# EAGLE design board (1) (EAGLE 9.6.2)
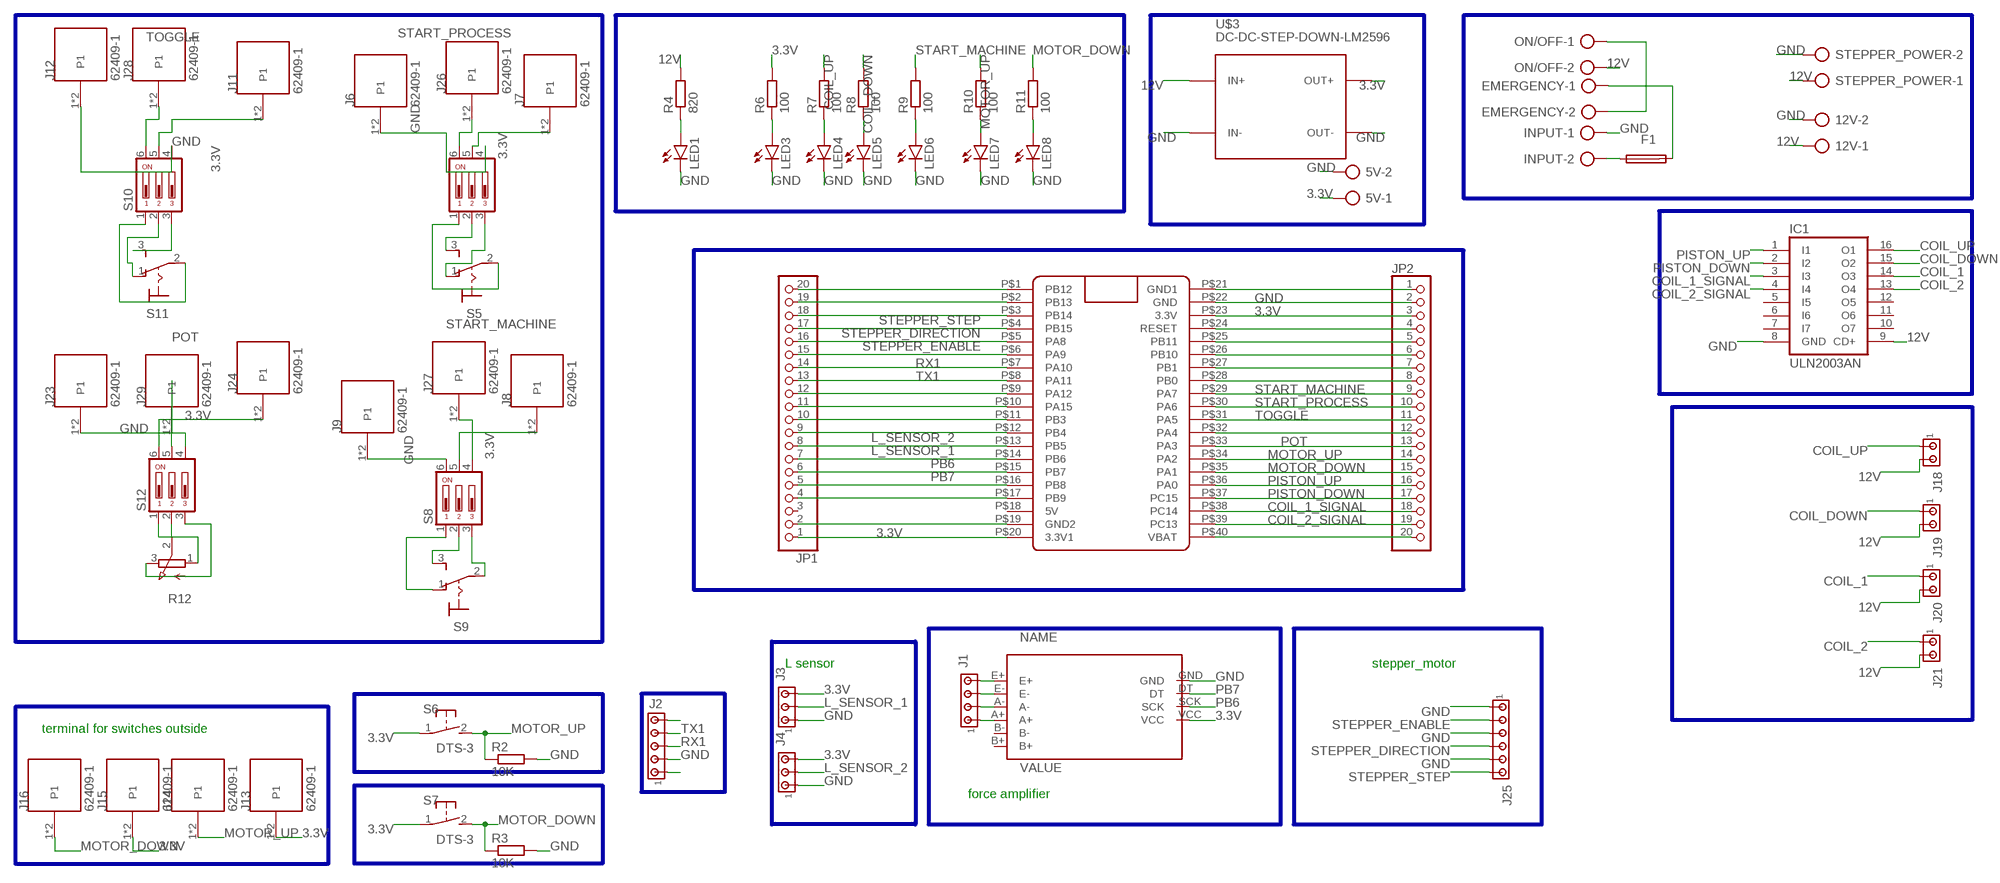
[diagram p0: schematic, sheet 1]

## Parts
5V  AK300/2  [AK300/2]
12V  AK300/2  [AK300/2]
EMERGENCY  AK300/2  [AK300/2]
F1  SH22  [SH22]
IC1  ULN2003AN  [DIL16]
INPUT  AK300/2  [AK300/2]
J1  MTA04-100  [10X04MTA]
J2  MTA05-100  [10X05MTA]
J3  MTA03-100  [10X03MTA]
J4  MTA03-100  [10X03MTA]
J6  62409-1  [TE_62409-1]
J7  62409-1  [TE_62409-1]
J8  62409-1  [TE_62409-1]
J9  62409-1  [TE_62409-1]
J11  62409-1  [TE_62409-1]
J12  62409-1  [TE_62409-1]
J13  62409-1  [TE_62409-1]
J14  62409-1  [TE_62409-1]
J15  62409-1  [TE_62409-1]
J16  62409-1  [TE_62409-1]
J18  MTA02-100  [10X02MTA]
J19  MTA02-100  [10X02MTA]
J20  MTA02-100  [10X02MTA]
J21  MTA02-100  [10X02MTA]
J23  62409-1  [TE_62409-1]
J24  62409-1  [TE_62409-1]
J25  MTA06-100  [10X06MTA]
J26  62409-1  [TE_62409-1]
J27  62409-1  [TE_62409-1]
J28  62409-1  [TE_62409-1]
J29  62409-1  [TE_62409-1]
JP1  PINHD-1X20  [1X20]
JP2  PINHD-1X20  [1X20]
LED1  LED3MM  [LED3MM]
LED3  LED3MM  [LED3MM]
LED4  LED3MM  [LED3MM]
LED5  LED3MM  [LED3MM]
LED6  LED3MM  [LED3MM]
LED7  LED3MM  [LED3MM]
LED8  LED3MM  [LED3MM]
ON/OFF  AK300/2  [AK300/2]
R2  10K  R-EU_0204/7  [0204/7]
R3  10K  R-EU_0204/7  [0204/7]
R4  820  R-EU_0204/7  [0204/7]
R6  100  R-EU_0204/7  [0204/7]
R7  100  R-EU_0204/7  [0204/7]
R8  100  R-EU_0204/7  [0204/7]
R9  100  R-EU_0204/7  [0204/7]
R10  100  R-EU_0204/7  [0204/7]
R11  100  R-EU_0204/7  [0204/7]
R12  3RP/1610N  [3RP/1610N]
S4  DP03  [DP-03]
S5  320-916  [320-916]
S6  DTS-3  [DTS-3]
S7  DTS-3  [DTS-3]
S8  DP03  [DP-03]
S9  320-916  [320-916]
S10  DP03  [DP-03]
S11  320-916  [320-916]
S12  DP03  [DP-03]
STEPPER_POWER  AK300/2  [AK300/2]
U$1  BLUE_PILL  [BLUE_PILL]
U$2  HX711A  [HX711]
U$3  DC-DC-STEP-DOWN-LM2596  [DC-DC-STEP-DOWN-LM2596]

## Nets
3.3V: 5V.1 J3.3 J4.3 J7.1 J7.2(P1) J8.1 J8.2(P1) J11.1 J11.2(P1) J13.1 J13.2(P1) J15.1 J15.2(P1) J24.1 J24.2(P1) JP1.1 JP2.3 R6.2 S4.5 S6.1 S7.1 S8.5 S10.5 S12.6 U$1.P$20(3.3V1) U$1.P$23(3.3V) U$2.VCC U$3.OUT+
12V: 12V.1 IC1.9(CD+) J18.2 J19.2 J20.2 J21.2 ON/OFF.2 R4.2 STEPPER_POWER.1 U$3.IN+
COIL_1: IC1.14(O3) J20.1
COIL_1_SIGNAL: IC1.3(I3) JP2.18 U$1.P$38(PC14)
COIL_2: IC1.13(O4) J21.1
COIL_2_SIGNAL: IC1.4(I4) JP2.19 U$1.P$39(PC13)
COIL_DOWN: IC1.15(O2) J19.1 R8.2
COIL_UP: IC1.16(O1) J18.1 R7.2
GND: 5V.2 12V.2 IC1.8(GND) INPUT.1 J2.2 J3.1 J4.1 J6.1 J6.2(P1) J9.1 J9.2(P1) J12.1 J12.2(P1) J23.1 J23.2(P1) J25.1 J25.3 J25.5 JP1.2 JP2.2 LED1.K(C) LED3.K(C) LED4.K(C) LED5.K(C) LED6.K(C) LED7.K(C) LED8.K(C) R2.2 R3.2 S4.4 S8.6 S10.4 S12.4 STEPPER_POWER.2 U$1.P$19(GND2) U$1.P$22(GND) U$2.GND U$3.IN- U$3.OUT-
L_SENSOR_1: J3.2 JP1.8 U$1.P$13(PB5)
L_SENSOR_2: J4.2 JP1.9 U$1.P$12(PB4)
MOTOR_DOWN: J16.1 J16.2(P1) JP2.15 R3.1 R11.2 S7.2 U$1.P$35(PA1)
MOTOR_UP: J14.1 J14.2(P1) JP2.14 R2.1 R10.2 S6.2 U$1.P$34(PA2)
N$1: J1.4 U$2.E+
N$2: J1.3 U$2.E-
N$3: J1.2 U$2.A-
N$4: J1.1 U$2.A+
N$5: LED1.A R4.1
N$7: LED3.A R6.1
N$8: LED4.A R7.1
N$9: LED5.A R8.1
N$10: LED6.A R9.1
N$11: LED7.A R10.1
N$12: LED8.A R11.1
N$13: F1.1 INPUT.2
N$14: S4.1 S5.2(P)
N$15: S4.2 S5.3(S)
N$16: JP1.4 U$1.P$17(PB9)
N$17: JP1.5 U$1.P$16(PB8)
N$18: JP1.10 U$1.P$11(PB3)
N$19: JP1.11 U$1.P$10(PA15)
N$20: JP1.12 U$1.P$9(PA12)
N$21: JP1.13 U$1.P$8(PA11)
N$22: EMERGENCY.1 F1.2
N$23: EMERGENCY.2 ON/OFF.1
N$24: J2.1
N$25: JP2.20 U$1.P$40(VBAT)
N$26: JP2.7 U$1.P$27(PB1)
N$27: JP2.8 U$1.P$28(PB0)
N$28: JP1.20 U$1.P$1(PB12)
N$29: JP1.19 U$1.P$2(PB13)
N$30: S4.3 S5.1(O)
N$31: S10.1 S11.2(P)
N$32: S8.3 S9.2(P)
N$33: S8.1 S9.1(O)
N$34: JP2.1 U$1.P$21(GND1)
N$35: JP2.4 U$1.P$24(RESET)
N$36: S8.2 S9.3(S)
N$37: S10.3 S11.3(S)
N$38: S10.2 S11.1(O)
N$39: J2.5
N$40: JP2.6 U$1.P$26(PB10)
N$41: R12.3(E) S12.3
N$42: R12.1(A) S12.1
N$43: R12.2(S) S12.2
N$44: JP2.12 U$1.P$32(PA4)
N$45: JP2.5 U$1.P$25(PB11)
PB6: JP1.7 U$1.P$14(PB6) U$2.SCK
PB7: JP1.6 U$1.P$15(PB7) U$2.DT
PISTON_DOWN: IC1.2(I2) JP2.17 U$1.P$37(PC15)
PISTON_UP: IC1.1(I1) JP2.16 U$1.P$36(PA0)
POT: J29.1 J29.2(P1) JP2.13 S12.5 U$1.P$33(PA3)
RX1: J2.3 JP1.15 U$1.P$6(PA9)
START_MACHINE: J27.1 J27.2(P1) JP2.9 R9.2 S8.4 U$1.P$29(PA7)
START_PROCESS: J26.1 J26.2(P1) JP2.10 S4.6 U$1.P$30(PA6)
STEPPER_DIRECTION: J25.4 JP1.17 U$1.P$4(PB15)
STEPPER_ENABLE: J25.2 JP1.16 U$1.P$5(PA8)
STEPPER_STEP: J25.6 JP1.18 U$1.P$3(PB14)
TOGGLE: J28.1 J28.2(P1) JP2.11 S10.6 U$1.P$31(PA5)
TX1: J2.4 JP1.14 U$1.P$7(PA10)
Unconnected: IC1.5(I5) IC1.6(I6) IC1.7(I7) IC1.10(O7) IC1.11(O6) IC1.12(O5) JP1.3 U$1.P$18(5V) U$2.B+ U$2.B-

## Buses
B$4
B$5
B$6
B$7
B$8
B$9
B$10
B$12
B$13
B$15
B$16
B$14
B$17
B$1

## Notes on the sheet
- L sensor | stepper_motor
- terminal for switches outside
- force amplifier

## Library data of the parts
5V 12V EMERGENCY INPUT ON/OFF STEPPER_POWER = con-ptr500:AK300/2: CONNECTOR; OC_FARNELL: unknown; OC_NEWARK: unknown
F1 = fuse:SH22: FUSE HOLDER CS PFP30, Schukat; OC_FARNELL: unknown; OC_NEWARK: unknown
IC1 = uln-udn:ULN2003A: DRIVER ARRAY
J1 = con-amp:MTA04-100: AMP connector
J2 = con-amp:MTA05-100: AMP connector
J3 J4 = con-amp:MTA03-100: AMP connector
J6-J9 J11-J16 J23 J24 J26-J29 = 62409-1:62409-1: CONN QC TAB 0.250 SOLDER Check availability <https://pricing.snapeda.com/parts/62409-1/TE%20Connectivity/view-part?ref=eda>; AVAILABILITY: In Stock; COMMENT: 62409-1; DESCRIPTION: Faston 20-16 AWG Straight Non-Insulated Printed Circuit Board Tab Terminal; MF: TE Connectivity; MP: 62409-1; PACKAGE: None; PRICE: None; PURCHASE-URL: https://pricing.snapeda.com/search/part/62409-1/?ref=eda
J18-J21 = con-amp:MTA02-100: AMP connector
J25 = con-amp:MTA06-100: AMP connector Connection corrected 2014-09-19
JP1 JP2 = pinhead:PINHD-1X20: PIN HEADER
LED1 LED3-LED8 = led:LED: LED OSRAM: - CHIPLED LG R971, LG N971, LY N971, LG Q971, LY Q971, LO R971, LY R971 LH N974, LH R974 LS Q976, LO Q976, LY Q976 LO Q996 - Hyper CHIPLED LW Q18S LB Q993, LB Q99A, LB R99A - SideLED LS A670, LO A670, LY A670, LG A670, LP A670 LB A673, LV A673, LT A673, LW A673 LH A674 LY A675 LS A676, LA A676, LO A676, LY A676, LW A676 LS A679, LY A679, LG A679 - Hyper Micro SIDELED® LS Y876, LA Y876, LO Y876, LY Y876 LT Y87S - SmartLED LW L88C, LW L88S LB L89C, LB L89S, LG L890 LS L89K, LO L89K, LY L89K LS L896, LA L896, LO L896, LY L896 - TOPLED LS T670, LO T670, LY T670, LG T670, LP T670 LSG T670, LSP T670, LSY T670, LOP T670, LYG T670 LG T671, LOG T671, LSG T671 LB T673, LV T673, LT T673, LW T673 LH T674 LS T676, LA T676, LO T676, LY T676, LB T676, LH T676, LSB T676, LW T676 LB T67C, LV T67C, LT T67C, LS T67K, LO T67K, LY T67K, LW E67C LS E67B, LA E67B, LO E67B, LY E67B, LB E67C, LV E67C, LT E67C LW T67C LS T679, LY T679, LG T679 LS T770, LO T770, LY T770, LG T770, LP T770 LB T773, LV T773, LT T773, LW T773 LH T774 LS E675, LA E675, LY E675, LS T675 LS T776, LA T776, LO T776, LY T776, LB T776 LHGB T686 LT T68C, LB T68C - Hyper Mini TOPLED® LB M676 - Mini TOPLED Santana® LG M470 LS M47K, LO M47K, LY M47K Source: http://www.osram.convergy.de LUXEON: - LUMILED® LXK2-PW12-R00, LXK2-PW12-S00, LXK2-PW14-U00, LXK2-PW14-V00 LXK2-PM12-R00, LXK2-PM12-S00, LXK2-PM14-U00 LXK2-PE12-Q00, LXK2-PE12-R00, LXK2-PE12-S00, LXK2-PE14-T00, LXK2-PE14-U00 LXK2-PB12-K00, LXK2-PB12-L00, LXK2-PB12-M00, LXK2-PB14-N00, LXK2-PB14-P00, LXK2-PB14-Q00 LXK2-PR12-L00, LXK2-PR12-M00, LXK2-PR14-Q00, LXK2-PR14-R00 LXK2-PD12-Q00, LXK2-PD12-R00, LXK2-PD12-S00 LXK2-PH12-R00, LXK2-PH12-S00 LXK2-PL12-P00, LXK2-PL12-Q00, LXK2-PL12-R00 Source: www.luxeon.com KINGBRIGHT: KA-3528ASYC Source: www.kingbright.com
R2-R4 R6-R11 = resistor:R-EU_: RESISTOR, European symbol
R12 = pot:3RP/1610N: 16mm Potentiometer one level Source: http://www.alphapotentiometers.net/html/16mm_pot_2.html
S4 S8 S10 S12 = switch-dil:DP03: DIL/CODE SWITCH; MPN: MCDP03; OC_FARNELL: 1522004; OC_NEWARK: 74M2976
S5 S9 S11 = switch:320-916: TOGGLE SWITCH distributor RS Components
S6 S7 = switch-tact:DTS-3
U$1 = BluePill:BLUE_PILL
U$2 = HX711:HX711
U$3 = buck 3A:DC-DC-STEP-DOWN-LM2596: DC/DC Step-Down Regulator based on LM2596-ADJ chip LM2596 datasheet available here: http://www.ti.com/lit/ds/symlink/lm2596.pdf Click here to find device on ebay.com <http://www.ebay.com/sch/lm2596+power+regulator>

## Board
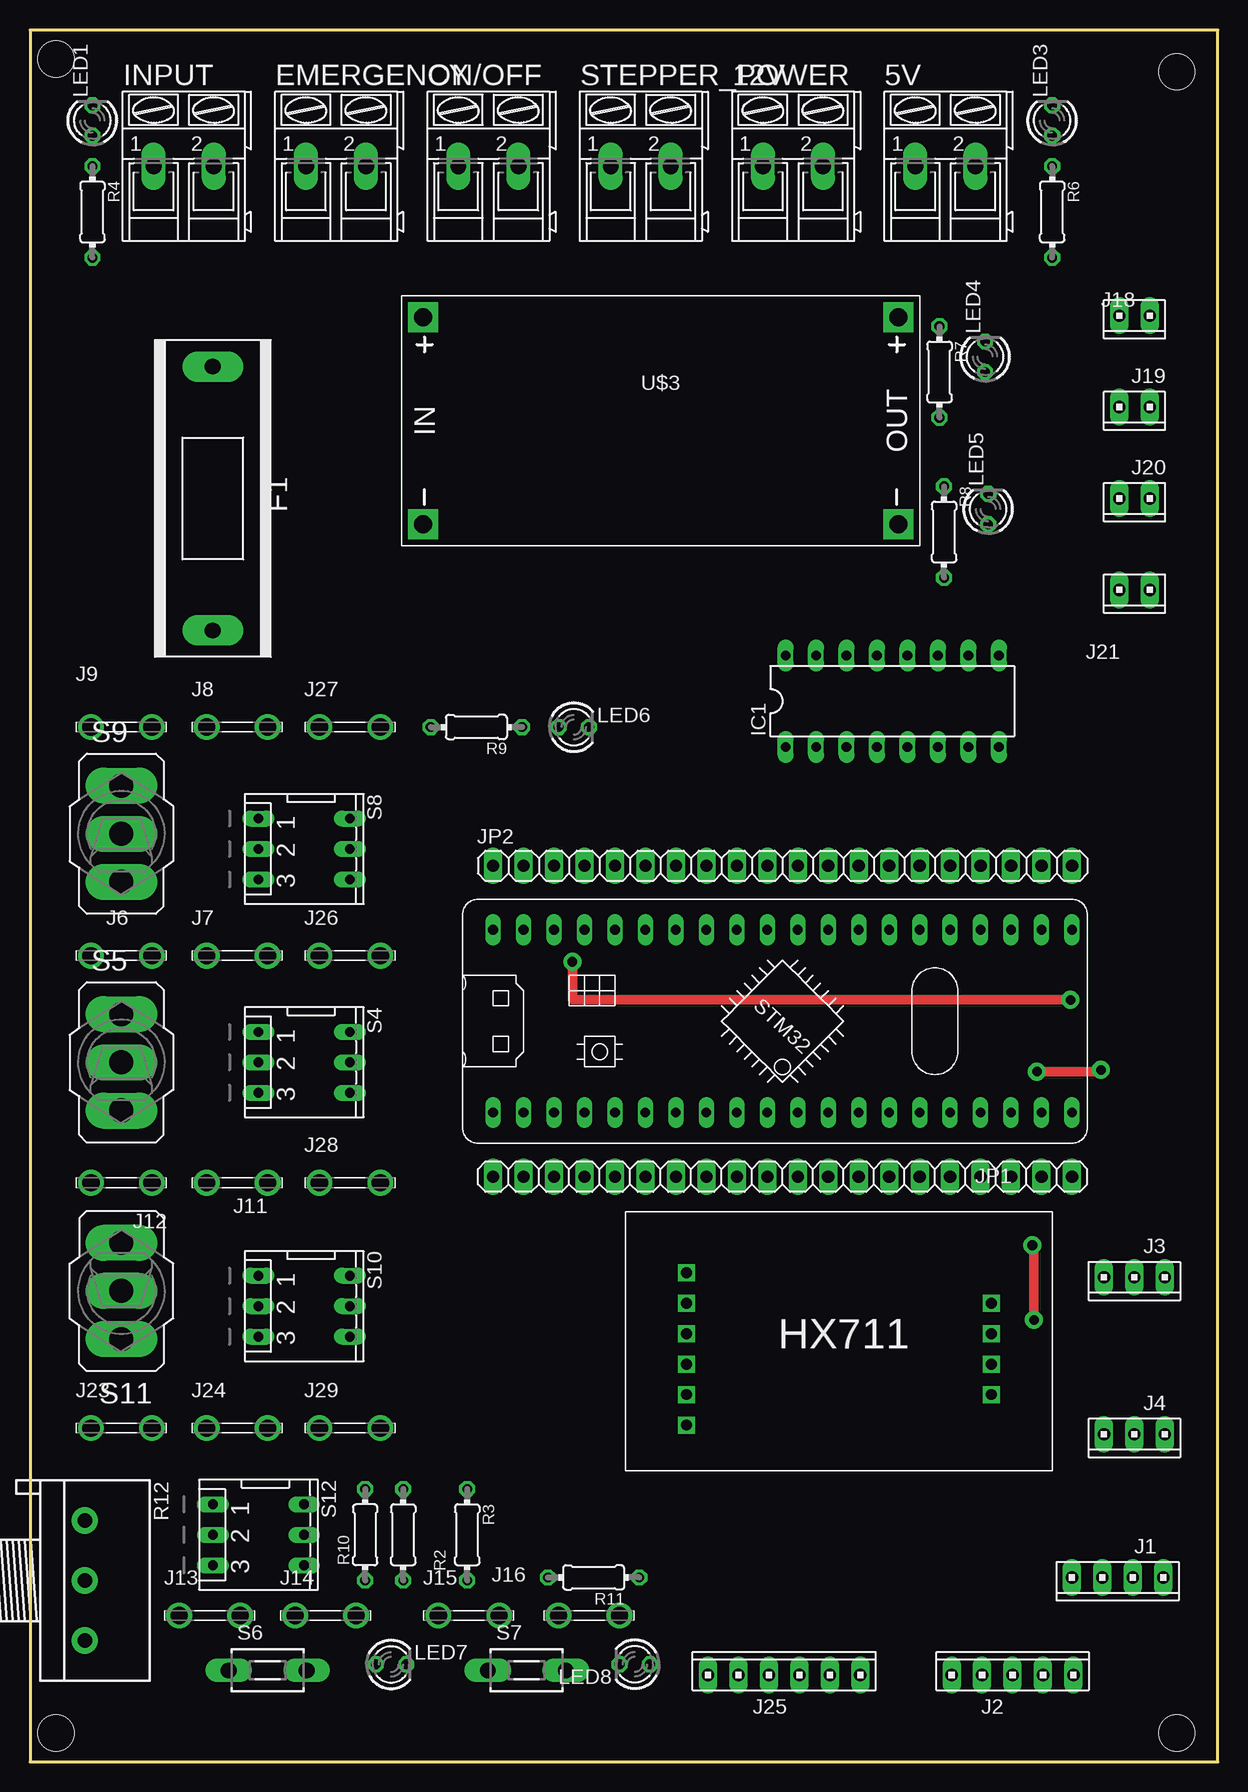
[diagram p1: board, top side]
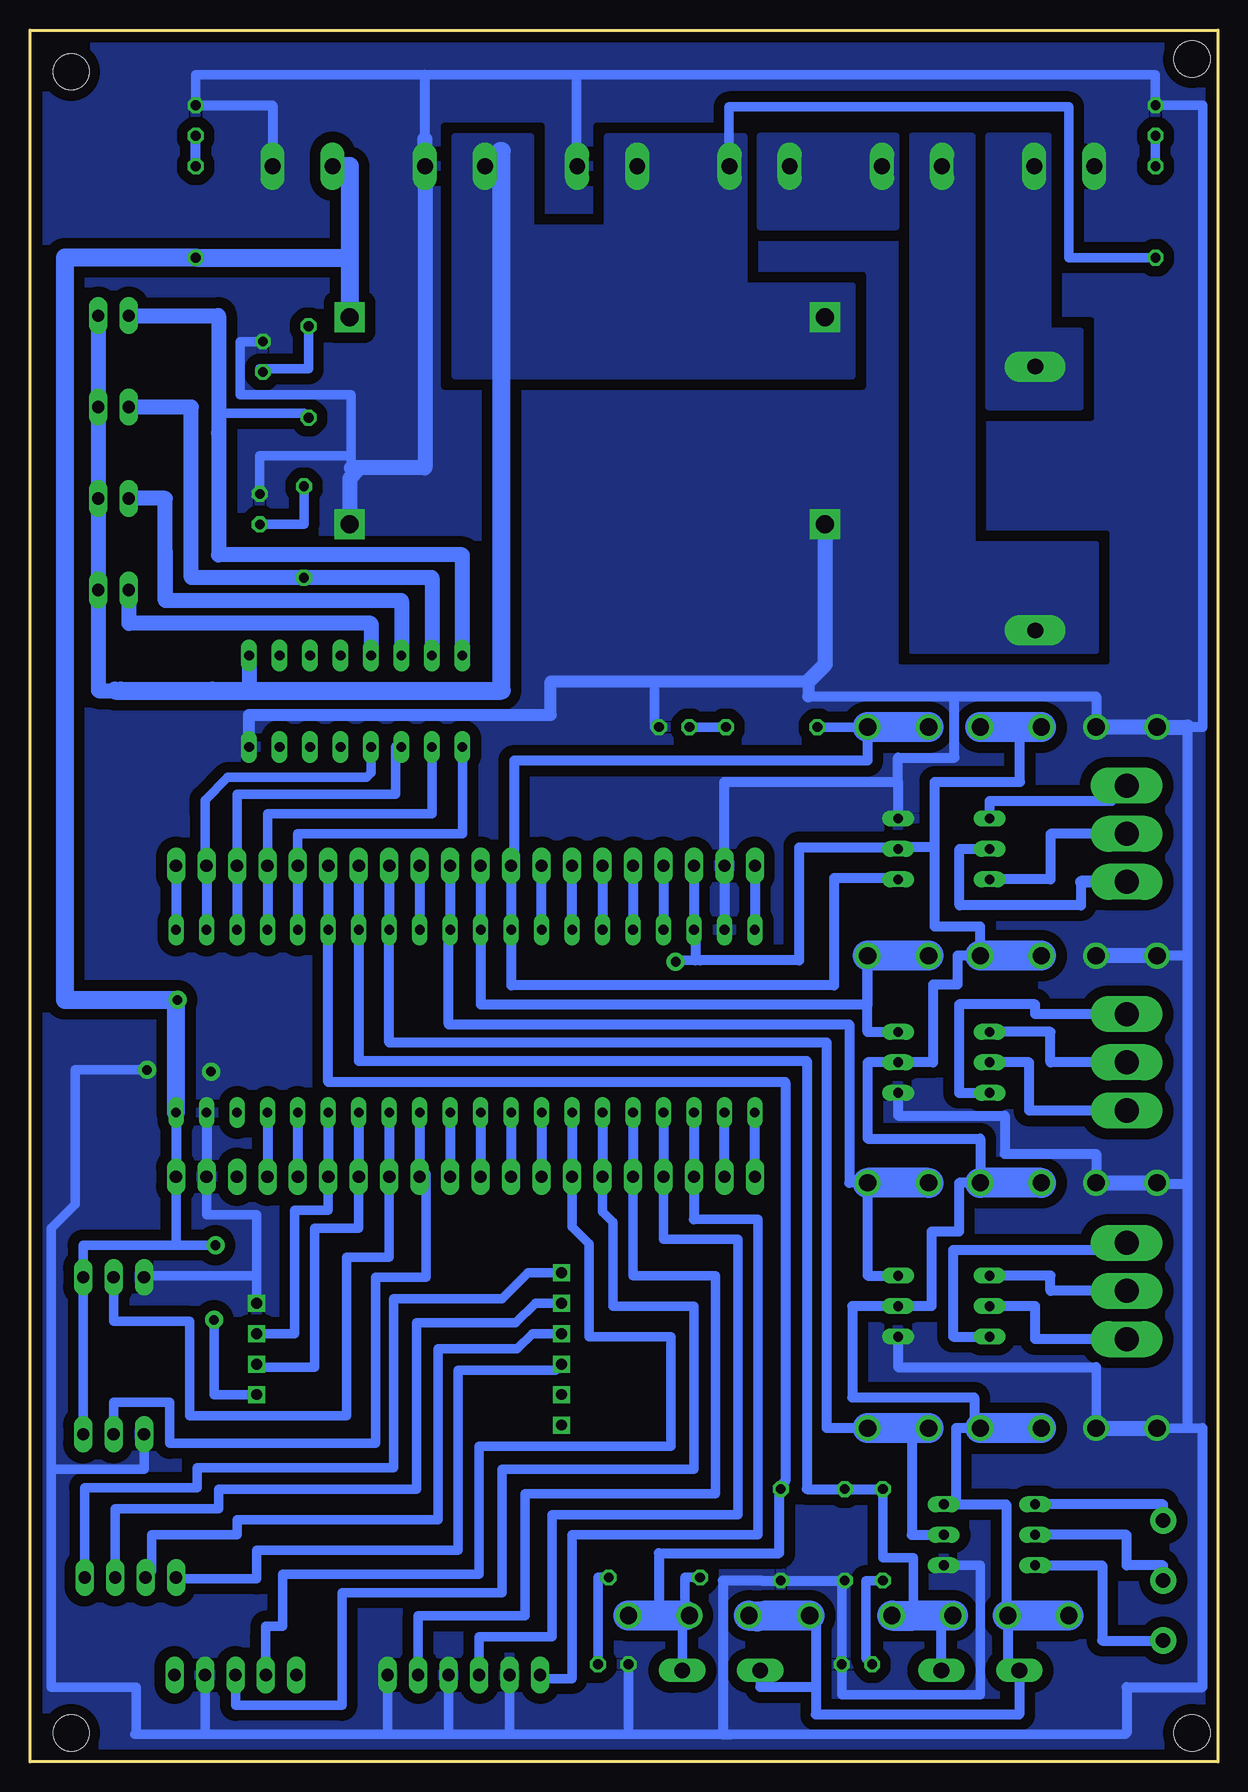
[diagram p2: board, bottom side, seen from below]

Size 99.04 x 144.32 mm. Coordinates in mm from the lower left corner, seen from the top.
Outline: 0,0 99.04,0 99.04,144.32 0,144.32 0,0
Copper layers (1*16): Top 0.035mm / dielectric 1.5mm / Bottom 0.035mm
Design rules "default *": minimum track width 0.6mm, minimum drill 0.35mm, track to track 0.6mm, track to pad 0.6mm, pad to pad 0.6mm, via to via 0.6mm, smd to smd 6mil, copper to edge 0.6mm, drill to drill 6mil, minimum pad ring 10mil, minimum via ring 8mil, stop-mask expansion 4mil, vias tented up to drill 0mil, thermal gap 0mil
Holes 3 mm at 2.16,141.91 2.16,2.41 95.61,2.41 95.61,140.84

### Footprints (pad centres in the part's own frame; a part is rotated, then mirrored left to right if it is on the bottom)
AK300/2 = drill 1.321 long: 1 -2.515,0; 2 2.489,0
SH22 = drill 1.321 pad 2.54 long: 1 -10.998,0; 2 10.998,0
DIL16 = drill 0.813 long: 1 -8.89,-3.81; 2 -6.35,-3.81; 3 -3.81,-3.81; 4 -1.27,-3.81; 5 1.27,-3.81; 6 3.81,-3.81; 7 6.35,-3.81; 8 8.89,-3.81; 9 8.89,3.81; 10 6.35,3.81; 11 3.81,3.81; 12 1.27,3.81; 13 -1.27,3.81; 14 -3.81,3.81; 15 -6.35,3.81; 16 -8.89,3.81
10X04MTA = drill 1.016 long: 1 3.81,0; 2 1.27,0; 3 -1.27,0; 4 -3.81,0
10X05MTA = drill 1.016 long: 1 5.08,0; 2 2.54,0; 3 0,0; 4 -2.54,0; 5 -5.08,0
10X03MTA = drill 1.016 long: 1 2.54,0; 2 0,0; 3 -2.54,0
TE_62409-1 = drill 1.43: 1 -2.54,0; 2 2.54,0
10X02MTA = drill 1.016 long: 1 1.27,0; 2 -1.27,0
10X06MTA = drill 1.016 long: 1 6.35,0; 2 3.81,0; 3 1.27,0; 4 -1.27,0; 5 -3.81,0; 6 -6.35,0
1X20 = drill 1.016 long: 1 -24.13,0; 2 -21.59,0; 3 -19.05,0; 4 -16.51,0; 5 -13.97,0; 6 -11.43,0; 7 -8.89,0; 8 -6.35,0; 9 -3.81,0; 10 -1.27,0; 11 1.27,0; 12 3.81,0; 13 6.35,0; 14 8.89,0; 15 11.43,0; 16 13.97,0; 17 16.51,0; 18 19.05,0; 19 21.59,0; 20 24.13,0
LED3MM = drill 0.813 octagon: A -1.27,0; K 1.27,0
0204/7 = drill 0.813 octagon: 1 -3.81,0; 2 3.81,0
3RP/1610N = drill 1.2 pad 2.184: 1 -5,0; 2 0,0; 3 5,0
DP-03 = drill 0.813 long: 1 -2.54,-3.81; 2 0,-3.81; 3 2.54,-3.81; 4 2.54,3.81; 5 0,3.81; 6 -2.54,3.81
320-916 = drill 2.007 long: 1 0,4.013; 2 0,0; 3 0,-4.013
DTS-3 = drill 1.3 long: 1 -3.25,0; 2 3.25,0
BLUE_PILL = drill 0.8 long: P$1 -7.62,15.24; P$2 -7.62,12.7; P$3 -7.62,10.16; P$4 -7.62,7.62; P$5 -7.62,5.08; P$6 -7.62,2.54; P$7 -7.62,0; P$8 -7.62,-2.54; P$9 -7.62,-5.08; P$10 -7.62,-7.62; P$11 -7.62,-10.16; P$12 -7.62,-12.7; P$13 -7.62,-15.24; P$14 -7.62,-17.78; P$15 -7.62,-20.32; P$16 -7.62,-22.86; P$17 -7.62,-25.4; P$18 -7.62,-27.94; P$19 -7.62,-30.48; P$20 -7.62,-33.02; P$21 7.62,15.24; P$22 7.62,12.7; P$23 7.62,10.16; P$24 7.62,7.62; P$25 7.62,5.08; P$26 7.62,2.54; P$27 7.62,0; P$28 7.62,-2.54; P$29 7.62,-5.08; P$30 7.62,-7.62; P$31 7.62,-10.16; P$32 7.62,-12.7; P$33 7.62,-15.24; P$34 7.62,-17.78; P$35 7.62,-20.32; P$36 7.62,-22.86; P$37 7.62,-25.4; P$38 7.62,-27.94; P$39 7.62,-30.48; P$40 7.62,-33.02
HX711 = drill 0.9 square: A+ 8.89,21.59; A- 8.89,24.13; B+ 8.89,16.51; B- 8.89,19.05; DT 34.29,24.13; E+ 8.89,29.21; E- 8.89,26.67; GND 34.29,26.67; SCK 34.29,21.59; VCC 34.29,19.05
DC-DC-STEP-DOWN-LM2596 = drill 1.5 pad 2.5 square: IN+ -19.812,8.636; IN- -19.812,-8.636; OUT+ 19.812,8.636; OUT- 19.812,-8.636

### Placement (x,y rotation side)
5V  76.33,132.97 0 top
12V  63.63,132.97 0 top
EMERGENCY  25.53,132.97 0 top
F1  15.24,105.28 270 top
IC1  71.88,88.39 0 top
INPUT  12.83,132.97 0 top
J1  90.68,15.37 180 top
J2  81.91,7.24 0 top
J3  92.08,40.39 180 top
J4  92.08,27.3 180 top
J6  7.62,67.18 0 top
J7  17.27,67.18 0 top
J8  17.27,86.23 0 top
J9  7.62,86.23 0 top
J11  17.27,48.26 180 top
J12  7.62,48.26 180 top
J13  14.99,12.19 0 top
J14  24.64,12.19 0 top
J15  36.58,12.19 0 top
J16  46.61,12.19 0 top
J18  92.08,120.52 180 top
J19  92.08,112.9 180 top
J20  92.08,105.28 180 top
J21  92.08,97.66 180 top
J23  7.62,27.81 0 top
J24  17.27,27.81 0 top
J25  62.87,7.24 0 top
J26  26.67,67.18 0 top
J27  26.67,86.23 0 top
J28  26.67,48.26 0 top
J29  26.67,27.81 0 top
JP1  62.74,48.77 180 top
JP2  62.74,74.68 0 top
LED1  5.21,136.78 90 top
LED3  85.22,136.78 90 top
LED4  79.63,117.09 90 top
LED5  79.88,104.39 90 top
LED6  45.34,86.23 0 top
LED7  30.1,8.13 0 top
LED8  50.42,8.13 180 top
ON/OFF  38.23,132.97 0 top
R2  31.11,18.92 270 top
R3  36.45,18.92 270 top
R4  5.21,129.16 270 top
R6  85.22,129.16 270 top
R7  75.82,115.82 270 top
R8  76.2,102.49 270 top
R9  37.21,86.23 180 top
R10  27.94,18.92 90 top
R11  46.99,15.37 180 top
R12  4.57,15.11 270 top
S4  22.86,58.29 270 top
S5  7.62,58.29 0 top
S6  19.81,7.62 0 top
S7  41.4,7.62 0 top
S8  22.86,76.07 270 top
S9  7.62,77.34 0 top
S10  22.86,37.97 270 top
S11  7.62,39.24 180 top
S12  19.05,18.92 270 top
STEPPER_POWER  50.93,132.97 0 top
U$1  53.85,61.72 90 top
U$2  45.85,11.56 0 top
U$3  52.58,111.76 0 top

### Tracks (layer width: path | path; a pad name or v marks a point on that pad's centre or on a via)
3.3V  (via drill 0.8 pad 1.5)
  Top 0.8: v83.69,36.83 83.69,43.05 v83.57,43.05 | v45.21,66.67 45.21,63.5 v86.74,63.5
  Bottom 0.8: 86.87,43.05 JP1.1 | 86.61,54.1 U$1.P$20 | 86.87,43.05 94.61,43.05 J3.3 J4.3 | U$2.VCC 83.69,30.61 v83.69,36.83 | v83.57,43.05 86.87,43.05 | 43.18,66.8 45.21,66.8 v45.21,66.67
  Bottom 0.813: 26.67,76.2 34.93,76.2 34.93,66.8 43.18,66.8 43.56,66.8 43.56,69.22 43.69,69.22 JP2.3 | 23.62,76.2 23.62,69.6 19.81,69.6 J7.2 21.72,67.18 21.72,64.77 23.75,64.77 23.75,58.29 S4.5 29.21,58.29 29.21,51.94 19.81,51.94 J11.1 21.59,48.26 21.59,44.2 23.88,44.2 23.88,37.97 S10.5 30.48,37.97 30.48,30.35 20.32,30.35 20.32,27.81 J24.2 21.84,27.81 21.84,21.46 S12.6 17.65,21.46 17.65,12.19 J13.2 17.53,7.62 S6.1 16.56,3.94 33.53,3.94 33.53,6.22 | 23.62,76.2 26.67,76.2 | 26.67,76.2 S8.5 | 23.62,76.2 23.62,81.66 16.51,81.66 16.51,86.23 | 86.87,48.13 JP1.1 U$1.P$20 | J15.1 33.53,12.09 33.53,6.22 | 33.53,6.22 38.15,6.22 S7.1
  Bottom 1: U$1.P$23 43.56,69.22
  Bottom 1.27: 38.42,12.12 37.72,12.19
  Bottom 1.5: 72.52,132.97 5V.1 72.39,132.97 72.39,125.35 | 72.39,125.35 U$3.OUT+ | 72.39,125.35 R6.2 96.14,125.35 96.14,63.5 v86.74,63.5 86.87,63.5 U$1.P$20
  Bottom 2.5: J8.1 16.51,86.23 J8.2 | J7.1 J7.2 | J11.2 J11.1 | J24.1 J24.2 | J15.1 37.72,12.19 | J15.2 38.42,12.12 | J13.1 J13.2
12V
  Bottom 0.8: ON/OFF.2 40.77,132.97 40.77,137.92 12.45,137.92 12.45,125.35 R4.2
  Bottom 1.27: IC1.9 80.77,89.28 | J18.2 J19.2 J20.2 J21.2 93.34,89.28 91.44,89.28
  Bottom 1.5: 12V.1 59.84,134.24 59.72,134.24 59.72,89.28 80.77,89.28 83.82,89.28 91.44,89.28 91.95,89.28
  pour Bottom: 39.5,135.51 39.5,123.06 30.48,123.06 30.48,115.44 63.63,115.44 63.63,135.51 57.28,135.51 57.28,127.89 50.93,127.89 50.93,135.51
COIL_1
  Bottom 1.27: IC1.14 68.07,96.77 87.76,96.77 | 87.76,100.84 87.76,96.77 | 87.76,96.77 87.76,105.28 J20.1
COIL_1_SIGNAL
  Bottom 0.8: JP2.18 81.79,80.65 68.58,80.65 68.58,84.58 IC1.3
  Bottom 0.813: JP2.18 U$1.P$38
COIL_2
  Bottom 1.27: IC1.13 70.61,94.87 90.8,94.87 J21.1
COIL_2_SIGNAL
  Bottom 0.8: 84.45,79.88 84.45,79.12 | 84.45,79.12 84.45,74.8 JP2.19 | 84.45,79.12 84.45,80.14 82.55,82.04 70.99,82.04 70.61,82.42 IC1.4
  Bottom 0.813: JP2.19 U$1.P$39
COIL_DOWN
  Bottom 1.27: J19.1 85.6,112.9 85.6,98.68 R8.2 65.53,98.68 IC1.15
COIL_UP
  Bottom 0.8: R7.2 76.2,112.4 81.03,112.4 82.3,112.4 83.31,112.4 83.31,110.74
  Bottom 1.27: IC1.16 62.99,100.58 83.31,100.58 83.31,110.74 83.31,120.52 J18.1
GND  (via drill 0.8 pad 1.5)
  Top 0.8: v83.95,57.53 89.28,57.53 v89.28,57.66
  Bottom 0.8: S12.4 19.81,16.38 19.81,5.59 31.37,5.59 LED7.K 31.37,15.11 R2.2 | J23.1 2.54,27.81 1.27,27.81 | 10.16,32.89 J23.2 | R3.2 38.1,15.11 | LED8.K 49.15,2.29 | 49.15,2.29 40.64,2.29 7.75,2.29 7.62,2.41 | J25.5 59.05,2.29 | 59.05,2.29 49.15,2.29 | J25.3 64.14,2.29 | 64.14,2.29 59.05,2.29 | J25.1 69.21,2.29 | 69.21,2.29 64.14,2.29 | J2.2 84.45,2.29 | 84.45,2.29 69.21,2.29 | LED3.K 85.22,140.59 66.17,140.59 53.47,140.59 | 53.47,140.59 5.21,140.59 LED1.K 1.27,138.05 1.27,86.23 | STEPPER_POWER.2 53.47,132.97 53.47,140.59 | LED6.K 46.99,86.23 46.99,90.04 | 84.45,2.29 90.3,2.29 | LED5.K 79.88,108.84 72.26,108.84 | LED4.K 81.53,118.36 81.53,113.92 72.26,113.92 72.26,108.84 | 72.26,108.84 72.26,107.82 | 80.01,38.35 U$2.GND 80.14,40.51 | 97.28,24.26 97.28,6.22 90.17,6.22 90.17,2.41 | J3.1 89.53,40.51 80.14,40.51 | J4.1 89.53,24.39 97.28,24.39 97.28,44.45 95.25,46.48 95.25,53.21 95.25,54.1 95.25,57.66 v89.28,57.66 | 84.2,48.77 JP1.2 84.33,45.59 80.14,45.59 80.14,40.51
  Bottom 0.813: 26.67,81.66 26.67,83.69 21.97,83.69 21.97,88.77 | 21.97,88.77 10.16,88.77 J9.2 | 26.67,81.66 41.15,81.66 JP2.2 U$1.P$22 | 26.67,81.66 S8.6 | U$1.P$19 JP1.2 | S4.4 26.67,53.85 17.78,53.85 17.78,50.67 10.16,50.67 J12.1 | S10.4 26.67,32.89 10.16,32.89 | 21.97,88.77 34.16,88.77 | 2.54,27.81 2.54,48.13 | 2.54,48.13 5.08,48.13 J12.2 | 2.54,48.13 2.54,67.18 | 2.54,67.18 J6.1 | 2.54,67.18 2.54,86.23 1.27,86.23 | R2.2 38.1,15.11 41.28,15.11 41.28,2.29 40.64,2.29 | 7.62,2.41 7.62,6.22 1.27,6.22 1.27,27.81 | 5V.2 78.82,138.05 LED3.K | 66.12,135.25 66.12,140.59 66.17,140.59
  Bottom 1: IC1.8 80.77,87.25 55.63,87.25 55.63,90.04 46.99,90.04 34.16,90.04 34.16,88.77
  Bottom 1.27: J6.1 J6.2 | J12.1 J12.2 | J23.2 J23.1 | J9.2 J9.1 2.54,86.23 | U$3.OUT- 72.39,106.93 71.5,107.82 | 71.5,107.82 66.12,107.82 12V.2 66.12,135.25 | 71.5,107.82 72.26,107.82 | U$3.IN- 32.77,91.44 34.16,90.04
  pour Bottom (isolate 0.9, rank 2): -6.35,145.92 105.41,145.92 105.41,-6.48 -6.35,-6.48
L_SENSOR_1
  Bottom 0.8: JP1.8 69.09,42.04 72.64,42.04 72.64,28.83 85.72,28.83 85.72,36.7 92.08,36.7 J3.2
  Bottom 0.813: U$1.P$13 JP1.8
L_SENSOR_2
  Bottom 0.8: 66.55,49.02 66.04,49.02 66.04,40.39 70.23,40.39 70.23,26.54 87.38,26.54 87.38,29.97 92.08,29.97 J4.2
  Bottom 0.813: U$1.P$12 66.55,49.02 JP1.9
MOTOR_DOWN
  Bottom 0.8: R3.1 36.58,22.73 | R11.2 44.45,15.37 44.45,12.19 | 44.65,12.19 S7.2
  Bottom 0.813: 44.45,12.19 J16.1 44.45,12.19 | JP2.15 U$1.P$35 74.17,56.64 36.07,56.64 36.07,23.37 36.58,22.86 36.58,22.73 36.58,17.4 46.61,17.4 46.61,12.19 44.45,12.19
  Bottom 1.27: J16.1 44.65,12.19
  Bottom 2.5: 44.45,12.19 J16.2
MOTOR_UP
  Bottom 0.8: 25.4,12.19 25.4,17.02 27.94,17.02 R10.2 R2.1
  Bottom 0.813: R10.2 34.29,22.73 34.29,58.42 71.63,58.42 U$1.P$34 JP2.14 | S6.2 23.06,11.68 J14.1
  Bottom 2.5: J14.1 25.4,12.19 J14.2
N$1
  Bottom 0.8: U$2.E+ 57.53,40.77 59.69,38.61 68.71,38.61 68.71,24.51 85.09,24.51 85.09,22.86 94.49,22.86 J1.4
N$2
  Bottom 0.8: U$2.E- 56.9,38.23 58.55,36.58 66.8,36.58 66.8,22.73 83.31,22.73 83.31,21.08 88.39,21.08 91.95,21.08 J1.3
N$3
  Bottom 0.8: U$2.A- 57.15,35.69 58.42,34.42 65.02,34.42 65.02,20.19 81.79,20.19 81.79,18.92 88.9,18.92 88.9,15.88 J1.2
N$4
  Bottom 0.8: U$2.A+ 55.25,32.64 63.37,32.64 63.37,17.65 80.14,17.65 80.14,15.24 86.61,15.24 J1.1
N$5
  Bottom 0.8: R4.1 LED1.A
N$7
  Bottom 0.813: R6.1 LED3.A
N$8
  Bottom 0.8: LED4.A 79.88,116.08 75.82,116.08 R7.1
N$9
  Bottom 0.8: R8.1 76.2,103.12 LED5.A
N$10
  Bottom 0.8: R9.1 LED6.A
N$11
  Bottom 0.8: R10.1 29.34,15.11 29.34,8.64 LED7.A
N$12
  Bottom 0.8: R11.1 51.69,15.37 LED8.A
N$13
  pour Bottom: 14.1,119.25 14.1,135.51 19.18,135.51 19.18,112.9 11.43,112.9 11.43,119.25
N$14
  Bottom 0.813: S5.2 13.97,58.29 13.97,60.83 S4.1
N$15
  Bottom 0.813: S5.3 15.75,54.28 15.75,58.29 S4.2
N$16
  Bottom 0.813: U$1.P$17 JP1.4
N$17
  Bottom 0.813: U$1.P$16 JP1.5
N$18
  Bottom 0.813: U$1.P$11 JP1.10
N$19
  Bottom 0.813: U$1.P$10 JP1.11
N$20
  Bottom 0.813: U$1.P$9 JP1.12
N$21
  Bottom 0.813: U$1.P$8 JP1.13
N$22
  pour Bottom: 20.45,135.51 25.53,135.51 25.53,92.58 10.16,92.58 10.16,101.47 20.45,101.47
N$23
  pour Bottom: 26.8,135.51 38.23,135.51 38.23,127.89 26.8,127.89
N$25
  Bottom 0.813: JP2.20 U$1.P$40
N$26
  Bottom 0.813: U$1.P$27 JP2.7
N$27
  Bottom 0.813: U$1.P$28 JP2.8
N$28
  Bottom 0.813: JP1.20 U$1.P$1
N$29
  Bottom 0.813: JP1.19 U$1.P$2
N$30
  Bottom 0.813: S5.1 15.24,62.31 15.24,63.12 21.59,63.12 21.59,55.75 S4.3
N$31
  Bottom 0.813: S11.2 13.97,39.24 13.97,40.51 S10.1
N$32
  Bottom 0.813: S9.2 13.97,77.34 13.97,73.53 S8.3
N$33
  Bottom 0.813: S9.1 8.89,80.09 19.05,80.09 S8.1
N$34
  Bottom 0.813: JP2.1 U$1.P$21
N$35
  Bottom 0.813: JP2.4 U$1.P$24
N$36
  Bottom 0.813: 11.43,73.33 11.43,71.37 21.55,71.37 21.55,76.07 S8.2
  Bottom 1: S9.3 11.43,73.33
N$37
  Bottom 0.813: S11.3 8.2,42.67 22.1,42.67 22.1,35.43 S10.3
N$38
  Bottom 0.813: S11.1 15.24,35.23 15.24,37.97 S10.2
N$40
  Bottom 0.813: JP2.6 U$1.P$26
N$41
  Bottom 0.813: S12.3 9.65,16.38 9.65,10.11 R12.3
N$42
  Bottom 0.813: R12.1 4.57,21.46 S12.1
N$43
  Bottom 0.813: R12.2 4.57,16.38 7.62,16.38 7.62,18.92 S12.2
N$44
  Bottom 0.813: JP2.12 U$1.P$32
N$45
  Bottom 0.813: JP2.5 U$1.P$25
PB6
  Bottom 0.8: JP1.7 71.63,44.45 75.31,44.45 75.31,32.89 79.88,32.89 U$2.SCK
  Bottom 0.813: U$1.P$14 JP1.7
PB7
  Bottom 0.8: U$2.DT 76.96,35.69 76.96,45.97 74.17,45.97 JP1.6
  Bottom 0.813: U$1.P$15 JP1.6
PISTON_DOWN
  Bottom 0.8: JP2.17 79.25,78.99 65.53,78.99 IC1.2
  Bottom 0.813: JP2.17 U$1.P$37
PISTON_UP
  Bottom 0.8: IC1.1 62.99,77.34 76.71,77.34 JP2.16
  Bottom 0.813: JP2.16 U$1.P$36
POT
  Bottom 0.813: J29.2 32.64,27.81 32.64,59.94 69.09,59.94 U$1.P$33 JP2.13 | S12.5 25.53,18.92 25.53,27.81
  Bottom 2.5: J29.2 J29.1 25.53,27.81
RX1
  Bottom 0.8: JP1.15 51.31,45.85 50.42,44.96 50.42,37.97 43.69,37.97 43.69,24.38 59.69,24.38 59.69,14.1 73.02,14.1 73.02,4.7 81.91,4.7 J2.3
  Bottom 0.813: U$1.P$6 JP1.15
START_MACHINE
  Bottom 0.8: J27.2 R9.2
  Bottom 0.813: S8.4 26.8,73.66 32,73.66 32,64.7 58.93,64.7 U$1.P$29 JP2.9 58.67,74.93 58.67,83.44 29.21,83.44 J27.2
  Bottom 2.5: J27.1 J27.2
START_PROCESS
  Bottom 0.813: JP2.10 U$1.P$30 61.47,63.12 29.21,63.12 J26.2 29.21,60.83 S4.6
  Bottom 2.5: J26.1 J26.2
STEPPER_DIRECTION
  Bottom 0.8: J25.4 61.6,10.41 55.5,10.41 55.5,20.57 40.01,20.57 40.01,43.56 46.23,43.56 46.23,49.02
  Bottom 0.813: U$1.P$4 46.23,49.02 JP1.17
STEPPER_ENABLE
  Bottom 0.8: J25.2 66.67,12.19 57.79,12.19 57.79,22.35 41.91,22.35 41.91,40.51 48.77,40.51 JP1.16
  Bottom 0.813: U$1.P$5 JP1.16
STEPPER_STEP
  Bottom 0.8: 43.69,45.21 38.35,45.21 38.35,18.92 53.85,18.92 53.85,6.94 56.52,6.94 J25.6
  Bottom 0.813: U$1.P$3 JP1.18 43.69,45.21
TOGGLE
  Bottom 0.813: 64.14,69.34 64.14,61.47 30.73,61.47 30.73,48.26 J28.2 29.21,40.51 S10.6 | JP2.11 U$1.P$31
  Bottom 1: 64.14,69.34 U$1.P$31
  Bottom 2.5: J28.1 J28.2
TX1
  Bottom 0.8: 77.98,12.57 77.98,15.62 61.6,15.62 61.6,26.29 45.59,26.29 45.59,35.43 52.45,35.43 52.45,43.18 53.85,44.58 JP1.14 | 77.98,12.57 77.98,12.06 | J2.4 79.38,10.03 | 79.38,10.03 79.38,10.67 | 77.98,12.57 77.98,11.3 79.38,11.3 79.38,10.03
  Bottom 0.813: U$1.P$7 JP1.14

### Text on the board
Document: 12V | 3.3v | Input Pwer | EMERGENCY | ON/OFF | Stepper | 12v | 3.3V | -VE | +VE | +VE | -VE | +VE | -VE | +VE | -VE | UP | Coil 1 | up | DOWN | DOWN | up | DOWN | Coil 2 | -VE | +VE | STOP | START | SIGNAL | Start | STOP | MACHINE | START | START | STOP | START | SIGNAL | STOP | PROCESS | START | SIGNAL | Tension | Comp | GND | Signal | 3.3v | TENSION | TEST | Signal | GND | 3.3v | UTM | Comp | Length | SIGNAL | SENSOR | GND | 3.3V | F SENSOR | 3.3V | A+ | A- | E- | E+ | GND | STEPPER | TTL | M UP | M DOWN | Step | GND | DIR | GND | EN | GND | TX | RX | GND